# EAGLE design tm4 (EAGLE 9.0.1)
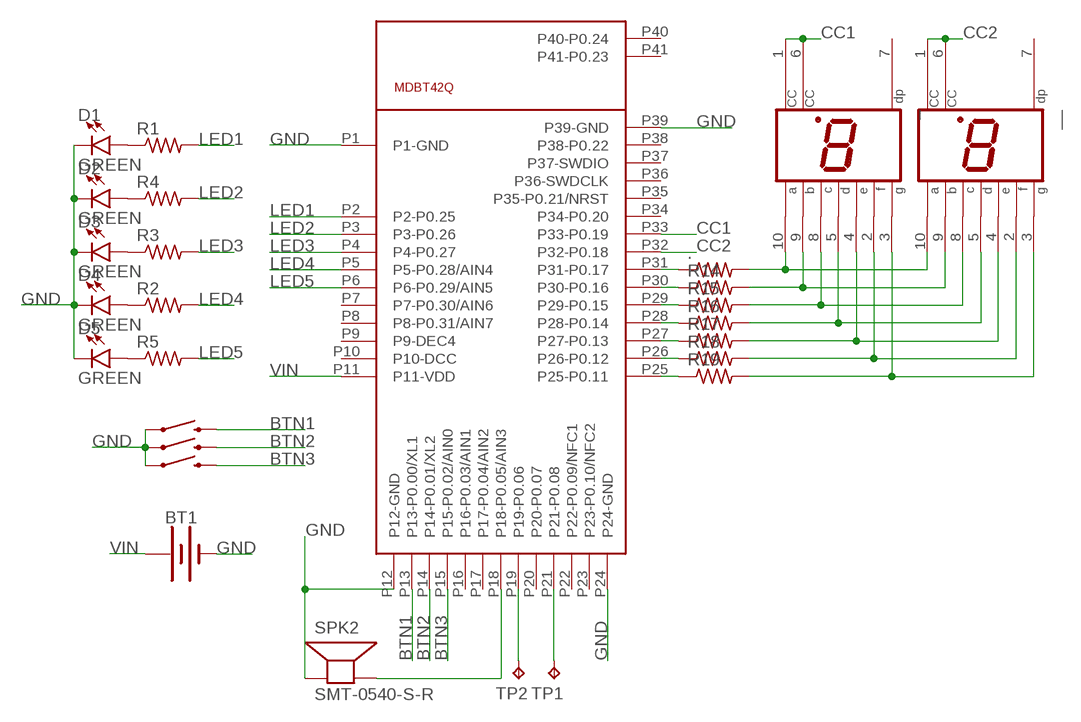
[diagram p0: schematic, sheet 1]

## Parts
.  R-US_M0805  [M0805]
_  HD-A103  [HDSP-A]
__  HD-A103  [HDSP-A]
____  MOMENTARY-SWITCH-SPST-SMD-6.2MM-TALL  [TACTILE_SWITCH_SMD_6.2MM_TALL]
_____  MOMENTARY-SWITCH-SPST-SMD-6.2MM-TALL  [TACTILE_SWITCH_SMD_6.2MM_TALL]
______  MOMENTARY-SWITCH-SPST-SMD-6.2MM-TALL  [TACTILE_SWITCH_SMD_6.2MM_TALL]
BT1  BATTERY-12MM_SMD  [BATTCON_12MM]
D1  GREEN  LED-GREEN1206  [LED-1206]
D2  GREEN  LED-GREEN1206  [LED-1206]
D3  GREEN  LED-GREEN1206  [LED-1206]
D4  GREEN  LED-GREEN1206  [LED-1206]
D5  GREEN  LED-GREEN1206  [LED-1206]
R1  R-US_M0805  [M0805]
R2  R-US_M0805  [M0805]
R3  R-US_M0805  [M0805]
R4  R-US_M0805  [M0805]
R5  R-US_M0805  [M0805]
R14  R-US_M0805  [M0805]
R15  R-US_M0805  [M0805]
R16  R-US_M0805  [M0805]
R17  R-US_M0805  [M0805]
R18  R-US_M0805  [M0805]
R19  R-US_M0805  [M0805]
SPK2  SMT-0540-S-R  [SMT-0540-S-R]
TP1  TPTP19R  [TP19R]
TP2  TPTP19R  [TP19R]
U$1  MDBT42Q  [MDBT40]

## Nets
A: ..2 _.10(A) __.10(A)
B: _.9(B) __.9(B) R14.2
BTN1: ____.B2 U$1.P13(P13-P0.00/XL1)
BTN2: _____.B2 U$1.P14(P14-P0.01/XL2)
BTN3: ______.B2 U$1.P15(P15-P0.02/AIN0)
C: _.8(C) __.8(C) R15.2
CC1: _.1(CC) _.6(CC) U$1.P33(P33-P0.19)
CC2: __.1(CC) __.6(CC) U$1.P32(P32-P0.18)
D: _.5(D) __.5(D) R16.2
E: _.4(E) __.4(E) R17.2
F: _.2(F) __.2(F) R18.2
G: _.3(G) __.3(G) R19.2
GND: ____.A2 _____.A2 ______.A2 BT1.GND(-) D1.C D2.C D3.C D4.C D5.C SPK2.-(+) U$1.P1(P1-GND) U$1.P12(P12-GND) U$1.P24(P24-GND) U$1.P39(P39-GND)
LED1: R1.2 U$1.P2(P2-P0.25)
LED2: R4.2 U$1.P3(P3-P0.26)
LED3: R3.2 U$1.P4(P4-P0.27)
LED4: R2.2 U$1.P5(P5-P0.28/AIN4)
LED5: R5.2 U$1.P6(P6-P0.29/AIN5)
N$1: ..1 U$1.P31(P31-P0.17)
N$2: R14.1 U$1.P30(P30-P0.16)
N$3: R15.1 U$1.P29(P29-P0.15)
N$4: D1.A R1.1
N$5: D2.A R4.1
N$6: D3.A R3.1
N$7: D4.A R2.1
N$8: R16.1 U$1.P28(P28-P0.14)
N$9: R17.1 U$1.P27(P27-P0.13)
N$10: R18.1 U$1.P26(P26-P0.12)
N$11: R19.1 U$1.P25(P25-P0.11)
N$13: SPK2.+(-) U$1.P18(P18-P0.05/AIN3)
N$16: D5.A R5.1
N$17: TP1.TP U$1.P21(P21-P0.08)
N$18: TP2.TP U$1.P19(P19-P0.06)
VIN: BT1.PWR@1(+) U$1.P11(P11-VDD)
Unconnected: _.7(DP) __.7(DP) U$1.P7(P7-P0.30/AIN6) U$1.P8(P8-P0.31/AIN7) U$1.P9(P9-DEC4) U$1.P10(P10-DCC) U$1.P16(P16-P0.03/AIN1) U$1.P17(P17-P0.04/AIN2) U$1.P20(P20-P0.07) U$1.P22(P22-P0.09/NFC1) U$1.P23(P23-P0.10/NFC2) U$1.P34(P34-P0.20) U$1.P35(P35-P0.21/NRST) U$1.P36(P36-SWDCLK) U$1.P37(P37-SWDIO) U$1.P38(P38-P0.22) U$1.P40(P40-P0.24) U$1.P41(P41-P0.23)

## Library data of the parts
. R1-R5 R14-R19 = adafruit:R-US_: RESISTOR, American symbol
_ __ = display-hp:HD-A103: LED DISPLAY 1-character 7 segment, decimal point right; OC_FARNELL: unknown; OC_NEWARK: unknown
____ _____ ______ = Sparkfun-switches:MOMENTARY-SWITCH-SPST: Momentary Switch (Pushbutton) - SPST Normally-open (NO) SPST momentary switches (buttons, pushbuttons). Variants PTH-12MM - 12mm square, through-hole Momentary Pushbutton Switch - 12mm Square <https://www.sparkfun.com/products/9190> (COM-09190) PTH-6.0MM, PTH-6.0MM-KIT - 6.0mm square, through-hole Mini Pushbutton Switch <https://www.sparkfun.com/products/97> (COM-00097) KIT package intended for soldering kit's - only one side of pads' copper is exposed. PTH-RIGHT-ANGLE-KIT - Right-angle, through-hole Right Angle Tactile Button <https://www.sparkfun.com/products/10791> - Used on SparkFun BigTime Watch Kit <https://www.sparkfun.com/products/11734> SMD-12MM - 12mm square, surface-mount Tactile Button - SMD (12mm) <https://www.sparkfun.com/products/12993> (COM-12993) Used on SparkFun PicoBoard <https://www.sparkfun.com/products/11888> SMD-4.5MM - 4.5mm Square Trackball Switch Used on SparkFun Blackberry Trackballer Breakout <https://www.sparkfun.com/products/13169> SMD-4.6MMX2.8MM - 4.60mm x 2.80mm, surface mount Used on SparkFun SAMD21 Mini Breakout <https://www.sparkfun.com/products/13664> SMD-5.2MM, SMD-5.2-REDUNDANT - 5.2mm square, surface-mount Mini Pushbutton Switch - SMD <https://www.sparkfun.com/products/8720> (COM-08720) Used on Arduino Pro Mini <https://www.sparkfun.com/products/11114> REDUNDANT package connects both switch circuits together SMD-6.0X3.5MM - 6.0 x 3.5mm, surface mount Momentary Reset Switch SMD <https://www.sparkfun.com/products/8229> (COM-08229) SMD-6.2MM-TALL - 6.2mm square, surface mount Tactile Button - SMD (6mm) <https://www.sparkfun.com/products/12992> Used on SparkFun Digital Sandbox <https://www.sparkfun.com/products/12651> SMD-RIGHT-ANGLE - Right-angle, surface mount Used on SparkFun Block for Intel® Edison - Arduino <https://www.sparkfun.com/products/13036>; PROD_ID: SWCH-11966; SF_SKU: COM-12992
BT1 = SparkFun-Batteries:BATTERY: Battery - Single Cell A variety of battery chemistries, sizes, and footprints. Device List: 20MM_PTH - Coin Cell Battery Holder - 20mm (PTH) <https://www.sparkfun.com/products/783> 6.8MM_PTH - Coin Cell Battery Holder - 6.8MM(SMD) <https://www.digikey.com/product-detail/en/seiko-instruments/MS621FE-FL11E/728-1057-ND/1889208?WT.srch=1&gclid=CNOQ5a6LzdQCFZS2wAodXCkE0g> 12MM_SMD - Coin Cell Battery Holder - 12mm (SMD) <https://www.sparkfun.com/products/10592> 12MM_PTH - Coin Cell Battery Holder - 12mm (PTH) <https://www.sparkfun.com/products/7948> 20MM_SMD - 20mm Coin Cell Battery Holder (SMD) (2 legs) Used on the Big Time Watch Kit <https://www.sparkfun.com/products/11734> 20MM_SMD_4LEGS - Coin Cell Battery Holder - 20mm (SMD) <https://www.sparkfun.com/products/11892> 20MM_SMD_4LEGS_OVERPASTE - Coin Cell Battery Holder - 20mm (SMD) <https://www.sparkfun.com/products/11892> (Over-paste on the legs) 24.5MM_PTH - Coin Cell Battery Holder - 24.5mm (PTH) <https://www.sparkfun.com/products/8863> 9V - 9V Battery Holder - PC Mount Used on the SparkFun SparkPunk Sound Kit <https://www.sparkfun.com/products/11177> and SparkFun SparkPunk Sequencer Kit <https://www.sparkfun.com/products/12707> 18650 - Battery Holder - 18650 (PTH) <https://www.sparkfun.com/products/13113> AA - Battery Holder - 1xAA (PTH) <https://www.sparkfun.com/products/7949> AAA - Battery Holder - 1xAAA (PTH) <https://www.sparkfun.com/products/12718> AA_KIT - Battery Holder - 1xAA (PTH) <https://www.sparkfun.com/products/7949> Special kit package - pads only have exposed copper on one side of the board. AAA_KIT - Battery Holder - 1xAAA (PTH) <https://www.sparkfun.com/products/12718> Special kit package - pads only have exposed copper on one side of the board.; PROD_ID: BATT-08044; SF_SKU: PRT-10592
D1-D5 = Sparkfun-LED:LED-GREEN: Green SMD LED Used in manufacturing of various products at SparkFun Packages: 0603 - SMD 0603 package [Product Link] <http://www.futureelectronics.com/en/technologies/semiconductors/optoelectronics/leds/Pages/9894312-LTST-C190GKT.aspx?CrossPart=HSMG-C190&IM=0> LilyPad 1206 - SMD1206 LilyPad package [Product Link] <http://www.futureelectronics.com/en/Technologies/Product.aspx?ProductID=IN150NGHARVATEKCORPORATION2049943&IM=0> 1206 - SMD1206 package [Product Link] <http://www.futureelectronics.com/en/technologies/semiconductors/optoelectronics/leds/Pages/8315665-LTST-C150KGKT.aspx?IM=0> 1206 Bottom Mount -SMD 1206 Bottom Mount [Product Link] <http://www.digikey.com/product-detail/en/lite-on-inc/LTST-C230KGKT/160-1456-1-ND/386854> SparkFun Products: Pro Mini 328 -5V <https://www.sparkfun.com/products/821> RedBoard <https://www.sparkfun.com/products/12757> MP3 Trigger <https://www.sparkfun.com/products/13720> Makey Makey <https://www.sparkfun.com/products/11076>; PROD_ID: DIO-00862
SPK2 = adafruit:SMT-0540-S-R: SMT-0549-S-R Small surface-mount magnetic buzzer
TP1 TP2 = testpad:TP: Test pad
U$1 = mdbt42:MDBT42Q

## Board
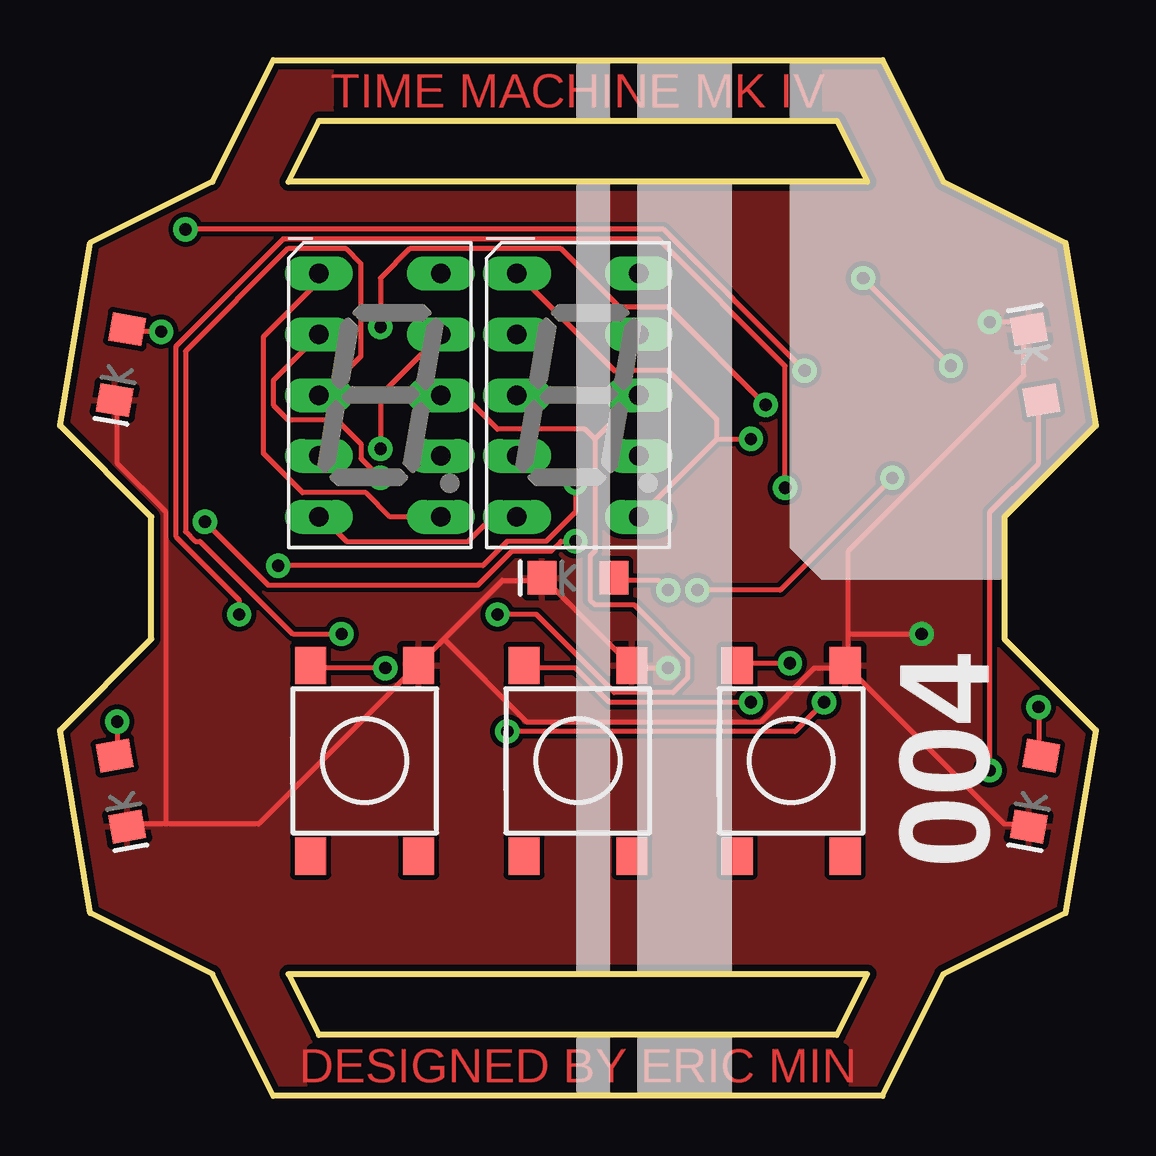
[diagram p1: board, top side]
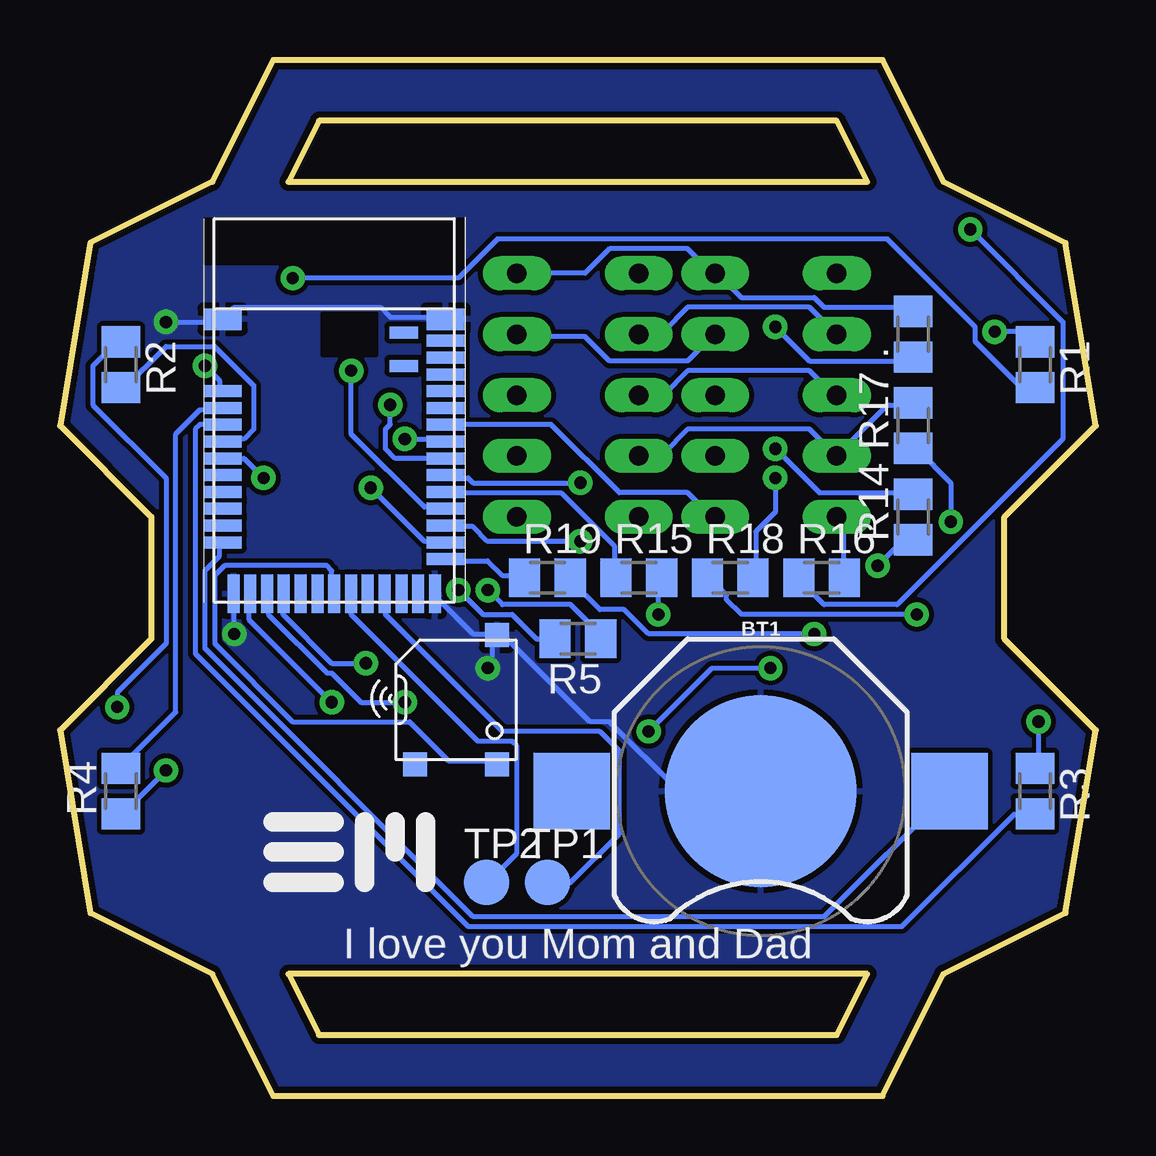
[diagram p2: board, bottom side, seen from below]

Size 43.18 x 43.18 mm. Coordinates in mm from the lower left corner, seen from the top.
Outline: 34.29,0 8.89,0 6.35,5.08 1.27,7.62 0,15.24 3.81,19.05 3.81,24.13 0,27.94 1.27,35.56 6.35,38.1 8.89,43.18 34.29,43.18 36.83,38.1 41.91,35.56 43.18,27.94 39.37,24.13 39.37,19.05 43.18,15.24 41.91,7.62 36.83,5.08 34.29,0
Outline: 9.53,38.1 10.79,40.64 32.38,40.64 33.65,38.1 9.53,38.1
Outline: 33.65,5.08 32.38,2.54 10.79,2.54 9.53,5.08 33.65,5.08
Copper layers (1*16): Top 0.035mm / dielectric 1.5mm / Bottom 0.035mm
Design rules "SparkFun": minimum track width 8mil, minimum drill 20mil, track to track 8mil, track to pad 8mil, pad to pad 8mil, via to via 8mil, smd to smd 8mil, copper to edge 10mil, drill to drill 8mil, minimum pad ring 12mil, minimum via ring 10mil, stop-mask expansion 4mil, vias tented up to drill 25mil, thermal gap 10mil

### Footprints (pad centres in the part's own frame; a part is rotated, then mirrored left to right if it is on the bottom)
M0805 = smd 1.3 x 1.6: 1 -0.95,0; 2 0.95,0
HDSP-A = drill 0.813 long: 1 -2.54,5.08; 2 -2.54,2.54; 3 -2.54,0; 4 -2.54,-2.54; 5 -2.54,-5.08; 6 2.54,-5.08; 7 2.54,-2.54; 8 2.54,0; 9 2.54,2.54; 10 2.54,5.08
TACTILE_SWITCH_SMD_6.2MM_TALL = smd 1.55 x 1.3: A1 -3.975,-2.25; A2 3.975,-2.25; B1 -3.975,2.25; B2 3.975,2.25
BATTCON_12MM = smd 8 x 8: GND 0,0 | smd 3.175 x 3.175: PWR@1 -7.874,0; PWR@2 7.874,0
LED-1206 = smd 1.2 x 1.4: A -1.5,0; C 1.5,0
SMT-0540-S-R = smd 1 x 1: + 1.7,-2.7; - 1.7,2.7; M -1.7,-2.7
TP19R = smd 1.9 x 1.9: TP 0,0
MDBT40 = smd 1.6 x 0.9: P1 -4.65,3.8; P39 4.65,3.8 | smd 1.6 x 0.5: P2 -4.65,0.8; P3 -4.65,0.1; P4 -4.65,-0.6; P5 -4.65,-1.3; P6 -4.65,-2; P7 -4.65,-2.7; P8 -4.65,-3.4; P9 -4.65,-4.1; P10 -4.65,-4.8; P11 -4.65,-5.5; P25 4.65,-6.2; P26 4.65,-5.5; P27 4.65,-4.8; P28 4.65,-4.1; P29 4.65,-3.4; P30 4.65,-2.7; P31 4.65,-2; P32 4.65,-1.3; P33 4.65,-0.6; P34 4.65,0.1; P35 4.65,0.8; P36 4.65,1.5; P37 4.65,2.2; P38 4.65,2.9 | smd 0.5 x 1.6: P12 -4.2,-7.65; P13 -3.5,-7.65; P14 -2.8,-7.65; P15 -2.1,-7.65; P16 -1.4,-7.65; P17 -0.7,-7.65; P18 0,-7.65; P19 0.7,-7.65; P20 1.4,-7.65; P21 2.1,-7.65; P22 2.8,-7.65; P23 3.5,-7.65; P24 4.2,-7.65 | smd 1.2 x 0.5: P40 2.9,3.25; P41 2.9,1.85

### Placement (x,y rotation side)
.  7.62,31.75 90 bottom
_  13.34,29.21 0 top
__  21.59,29.21 0 top
____  12.7,13.97 90 top
_____  21.59,13.97 90 top
______  30.48,13.97 90 top
BT1  13.97,12.7 180 bottom
D1  2.54,30.48 260 top
D2  40.64,30.48 100 top
D3  2.54,12.7 280 top
D4  40.64,12.7 260 top
D5  21.59,21.59 180 top
R1  2.54,30.48 270 bottom
R2  40.64,30.48 270 bottom
R3  2.54,12.7 270 bottom
R4  40.64,12.7 90 bottom
R5  21.59,19.05 180 bottom
R14  7.62,24.13 90 bottom
R15  19.05,21.59 0 bottom
R16  11.43,21.59 0 bottom
R17  7.62,27.94 90 bottom
R18  15.24,21.59 0 bottom
R19  22.86,21.59 0 bottom
SPK2  26.67,16.51 0 bottom
TP1  22.86,8.89 0 bottom
TP2  25.4,8.89 0 bottom
U$1  31.75,28.57 0 bottom

### Tracks (layer width: path | path; a pad name or v marks a point on that pad's centre or on a via)
A
  Bottom 0.203: ..2 7.67,32.87 11.33,32.87 11.74,33.27 14.78,33.27 15.8,34.29 _.10 16,34.29 17.02,35.31 20.27,35.31 21.29,34.29 __.10
B  (via drill 0.51)
  Top 0.203: v13.36,26.98 13.36,29.21 15.8,31.65 _.9
  Bottom 0.203: v13.36,26.98 11.53,25.15 7.67,25.15 R14.2 | __.9 24.13,31.65 21.29,31.65 20.27,30.63 17.02,30.63 16,31.65 _.9
BTN1  (via drill 0.51)
  Top 0.203: v13.56,17.83 10.52,17.83 ____.B2 | v18.64,15.19 30.63,15.19 v31.85,16.41
  Bottom 0.203: v13.56,17.83 16,17.83 v18.64,15.19 | v31.85,16.41 35.31,19.86 35.31,20.88 U$1.P13
BTN2  (via drill 0.51)
  Top 0.203: v28.8,16.41 22.91,16.41 21.49,17.83 19.46,17.83 _____.B2
  Bottom 0.203: v28.8,16.41 30.63,16.41 31.85,17.63 32.05,17.63 34.49,20.07 34.49,20.88 U$1.P14
BTN3  (via drill 0.51)
  Top 0.203: v30.43,18.03 28.4,18.03 ______.B2
  Bottom 0.203: v30.43,18.03 31.85,18.03 33.88,20.07 33.88,20.88 U$1.P15
C  (via drill 0.51)
  Top 0.203: v18.24,20.07 19.86,20.07 23.11,16.82 25.55,16.82 26.16,17.42 26.16,18.24 23.93,20.47 22.3,20.47 22.1,20.68 22.1,22.5 22.3,22.71 22.3,27.38 | __.8 22.3,27.38 | _.8 16.82,29.21 18.24,27.79 21.89,27.79 22.3,27.38
  Bottom 0.203: v18.24,20.07 18.24,21.49 R15.2
CC1
  Top 0.203: _.6 13.77,24.13 12.75,25.15 10.11,25.15 8.48,26.77 8.48,31.65 10.72,33.88 10.72,34.29 _.1
  Bottom 0.203: U$1.P33 26.98,27.99 22.71,27.99 19.86,25.15 17.02,25.15 16,24.13 _.6
CC2  (via drill 0.51)
  Top 0.203: 27.38,27.38 v28.8,27.38 | __.6 27.38,27.38 | __.1 23.11,30.23 25.35,30.23 27.38,28.19 27.38,27.38
  Bottom 0.203: v28.8,27.38 27.18,27.38 U$1.P32
D
  Top 0.203: __.5 18.03,24.13 17.02,23.11 11.94,23.11 10.92,24.13 _.5
  Bottom 0.203: R16.2 10.52,21.69 10.52,23.93 10.72,24.13 _.5
E
  Bottom 0.203: R17.2 7.67,28.8 8.69,28.8 10.72,26.77 _.4 10.92,26.77 11.94,27.79 17.02,27.79 18.03,26.77 19.05,26.77 __.4
F  (via drill 0.51)
  Top 0.203: v13.36,25.76 12.55,26.57 12.55,27.18 11.53,28.19 9.5,28.19 8.89,28.8 8.89,29.82 10.72,31.65 _.2
  Bottom 0.203: v13.36,25.76 13.36,24.33 14.17,23.52 14.17,21.69 R18.2 | __.2 19.05,31.85 18.03,31.85 17.02,32.87 11.94,32.87 10.92,31.85 _.2
G  (via drill 0.51)
  Top 0.203: v11.74,19.25 9.7,19.25 5.84,23.11 5.64,23.11 5.23,23.52 5.23,31.04 9.5,35.31 11.94,35.31 12.55,34.7 12.55,30.84 10.92,29.21 _.3
  Bottom 0.203: v11.74,19.25 18.64,19.25 19.66,20.27 20.68,20.27 21.89,21.49 R19.2 | __.3 18.03,29.21 17.02,30.23 11.94,30.23 10.92,29.21 _.3
GND  (via drill 0.51)
  Top 0.203: D4.C 40.18,11.33 39.37,11.33 32.87,17.83 ______.A2 | 32.87,19.25 32.87,18.03 ______.A2 | 32.87,19.25 32.87,22.71 40.18,30.02 40.18,31.85 D2.C 40.18,32.05 39.98,32.26 v38.76,32.26 | 32.87,19.25 v35.92,19.25 | 4.42,11.33 8.28,11.33 14.78,17.83 ____.A2 14.99,18.03 16,19.05 | 4.42,11.33 3,11.33 D3.C | 4.42,11.33 4.42,24.33 2.39,26.37 2.39,28.8 D1.C | 16,19.05 18.44,21.49 20.07,21.49 D5.C 20.27,21.49 23.72,18.03 _____.A2 23.93,17.83 v25.35,17.83 | 16,19.05 19.46,15.6 29.21,15.6 31.45,17.83 32.66,17.83 ______.A2
  Bottom 0.203: U$1.P39 27.18,32.46 29.41,32.46 29.82,32.87 35.92,32.87 36.32,32.46 U$1.P1 36.52,32.26 v38.76,32.26 | v35.92,19.25 35.92,20.88 U$1.P12 | SPK2.- 25.15,19.25 25.96,19.25 27.58,20.88 U$1.P24 | SPK2.- 24.94,19.05 24.54,19.05 21.08,15.6 20.27,15.6 17.42,12.75 13.97,12.75 BT1.GND | v25.35,17.83 25.15,18.03 25.15,19.05 SPK2.-
  pour Bottom: -7.62,46.99 -7.62,-3.81 49.53,-3.81 49.53,46.99
  pour Top: -6.35,44.45 -6.35,-2.54 48.26,-2.54 48.26,44.45
LED1  (via drill 0.51)
  Top 0.203: v33.48,34.09 v37.13,30.43
  Bottom 0.203: v37.13,30.43 36.52,29.82 36.52,29.41 U$1.P2 | v33.48,34.09 26.57,34.09 24.94,35.71 8.69,35.71 5.03,32.05 5.03,31.45 3.2,29.62 2.59,29.62 R1.2
LED2
  Bottom 0.203: U$1.P3 36.52,28.6 37.34,28.6 38.35,27.58 38.35,16 40.59,13.77 R4.2
LED3
  Bottom 0.203: R3.2 2.59,11.74 3.4,11.74 8.08,7.06 26.16,7.06 37.54,18.44 37.54,27.79 37.34,27.99 36.52,27.99 U$1.P4
LED4
  Bottom 0.203: U$1.P5 36.32,27.38 35.51,27.38 35.1,27.79 35.1,29.62 36.73,31.24 38.76,31.24 40.59,29.41 R2.2
LED5  (via drill 0.51)
  Top 0.203: v26.57,21.08 30.02,21.08 v34.7,25.76
  Bottom 0.203: R5.2 23.32,19.05 24.33,20.07 25.55,20.07 v26.57,21.08 | v34.7,25.76 35.51,26.57 36.32,26.57 U$1.P6
N$1  (via drill 0.51)
  Top 0.203: v13.36,32.05 13.36,34.09 14.58,35.31 20.88,35.31 23.32,32.87 25.35,32.87 v29.41,28.8
  Bottom 0.203: v13.36,32.05 11.94,30.63 7.67,30.63 ..1 | v29.41,28.8 29.41,27.99 29.62,27.79 29.62,26.98 29.21,26.57 27.18,26.57 U$1.P31
N$2  (via drill 0.51)
  Top 0.203: v9.09,22.1 17.63,22.1 18.64,23.11 20.27,23.11 21.49,24.33 v21.49,25.55
  Bottom 0.203: v9.09,22.1 8.08,23.11 7.67,23.11 R14.1 | v21.49,25.55 25.96,25.55 26.16,25.76 26.98,25.76 U$1.P30
N$3
  Bottom 0.203: R15.1 20.07,21.69 20.07,22.91 22.3,25.15 26.98,25.15 U$1.P29
N$4  (via drill 0.51)
  Top 0.203: v4.22,31.85 3,31.85 D1.A
  Bottom 0.203: v4.22,31.85 3,31.85 2.59,31.45 R1.1
N$5  (via drill 0.51)
  Top 0.203: v38.76,13.56 38.76,24.33 40.79,26.37 40.79,28.8 D2.A
  Bottom 0.203: v38.76,13.56 40.59,11.74 R4.1
N$6  (via drill 0.51)
  Top 0.203: v2.39,15.6 2.39,14.38 D3.A
  Bottom 0.203: v2.39,15.6 2.39,13.77 R3.1
N$7  (via drill 0.51)
  Top 0.203: v40.79,16.21 40.79,14.38 D4.A
  Bottom 0.203: v40.79,16.21 40.79,16.82 38.76,18.85 38.76,25.76 41.81,28.8 41.81,30.43 40.79,31.45 R2.1
N$8  (via drill 0.51)
  Top 0.203: v5.23,36.12 25.15,36.12 v31.04,30.23
  Bottom 0.203: v5.23,36.12 1.37,32.26 1.37,27.38 8.28,20.47 11.33,20.47 12.34,21.49 R16.1 | v31.04,30.23 31.04,27.58 27.99,24.54 27.18,24.54 U$1.P28
N$9  (via drill 0.51)
  Top 0.203: v21.49,23.11 20.88,23.11 20.47,22.71 18.85,22.71 17.42,21.29 8.69,21.29 v6.04,23.93
  Bottom 0.203: v21.49,23.11 25.35,23.11 25.96,23.72 26.98,23.72 U$1.P27 | v6.04,23.93 6.04,25.55 7.47,26.98 R17.1
N$10  (via drill 0.51)
  Top 0.203: v7.47,20.07 7.47,20.68 4.83,23.32 4.83,31.24 9.3,35.71 24.94,35.71 30.23,30.43 v30.23,25.35
  Bottom 0.203: v7.47,20.07 14.78,20.07 15.39,20.68 15.39,20.88 16,21.49 R18.1 | v30.23,25.35 27.99,23.11 27.18,23.11 U$1.P26
N$11
  Bottom 0.203: R19.1 23.93,21.69 24.74,21.69 25.35,22.3 26.98,22.3 U$1.P25
N$13
  Bottom 0.203: SPK2.+ 25.15,13.97 26.98,13.97 28.6,15.6 33.48,15.6 36.73,18.85 36.73,21.69 36.32,22.1 32.05,22.1 31.85,21.89 31.85,21.08 U$1.P18
N$16  (via drill 0.51)
  Top 0.203: v25.35,21.08 24.94,21.49 23.11,21.49 D5.A
  Bottom 0.203: v25.35,21.08 24.74,20.47 21.89,20.47 20.47,19.05 R5.1
N$17
  Bottom 0.203: TP1.TP 21.89,8.89 19.86,10.92 19.86,14.38 20.68,15.19 24.74,15.19 29.62,20.07 29.62,20.88 U$1.P21
N$18
  Bottom 0.203: U$1.P19 31.04,20.88 31.04,20.07 25.76,14.78 24.33,14.78 24.13,14.58 24.13,10.11 25.35,8.89 TP2.TP
VIN
  Bottom 0.203: BT1.PWR@1 11.33,7.47 25.96,7.47 37.13,18.64 37.13,21.89 36.52,22.5 36.52,22.91 U$1.P11

### Text on the board
Top: TIME MACHINE MK IV | DESIGNED BY ERIC MIN
tPlace: 004
bPlace: I love you Mom and Dad
tStop: TIME MACHINE MK IV | DESIGNED BY ERIC MIN